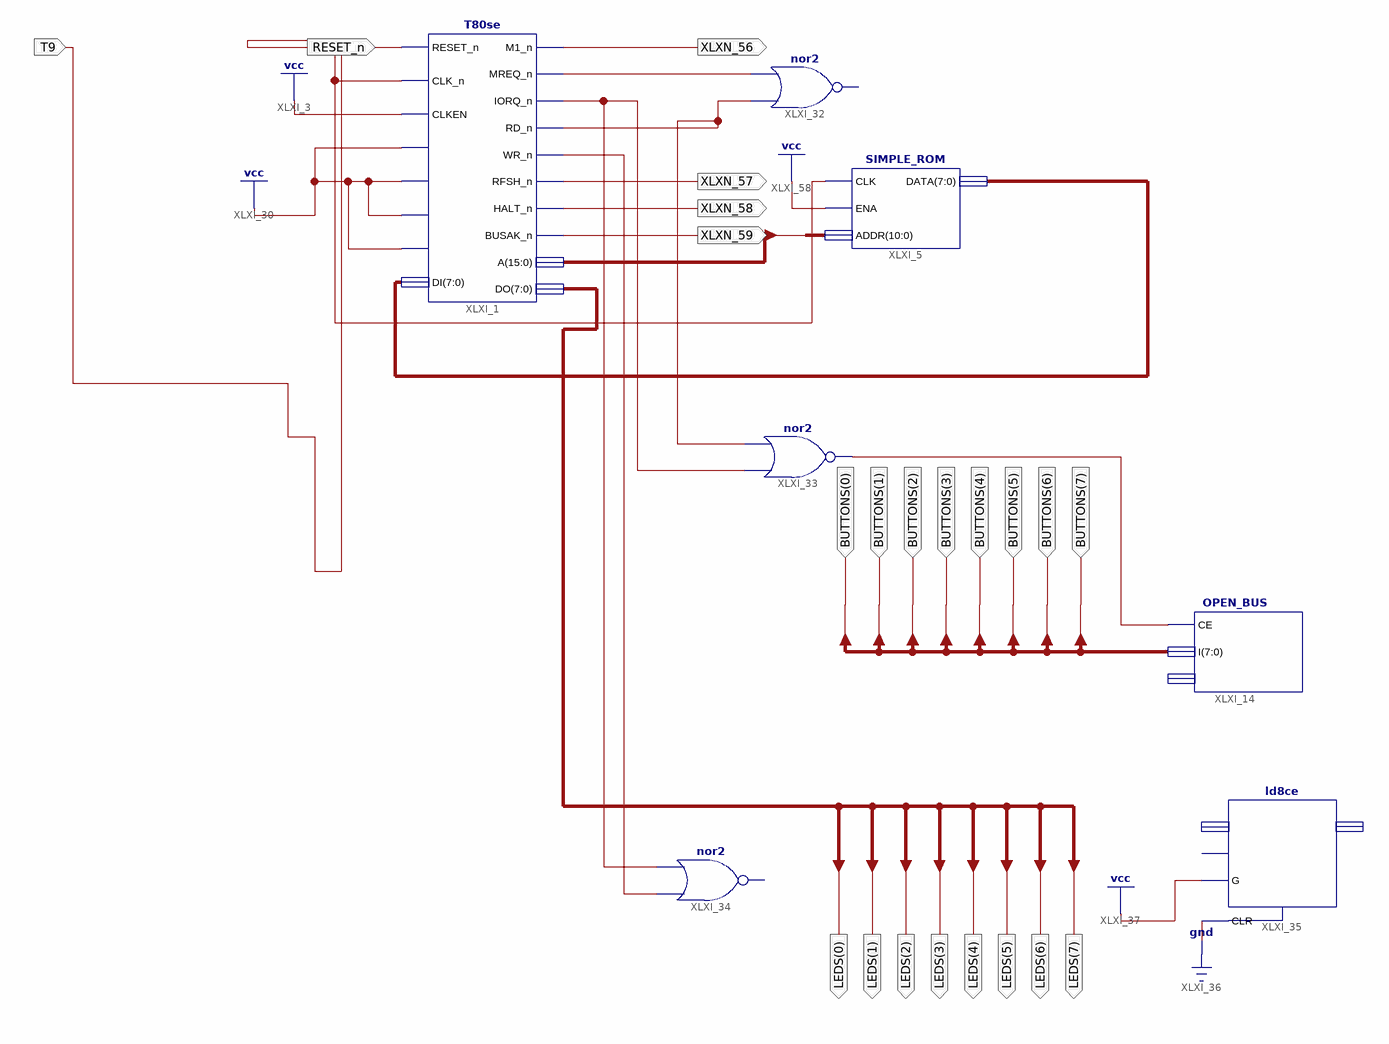
[diagram p0: schematic sheet 1]
// Xilinx ISE schematic ZAP_barbare.sch (spartan3) as structural Verilog: 7 symbols, 22 ports
module ZAP_barbare (
  input  RESET_n,
  input  [7:0] BUTTONS,
  input  T9,
  output XLXN_56,
  output XLXN_57,
  output XLXN_58,
  output XLXN_59,
  output [7:0] LEDS
);

  wire XLXN_10, XLXN_11, XLXN_31, XLXN_33, XLXN_83;
  wire [7:0] XLXN_189;
  wire [15:0] ADDRESSES;

  T80se XLXI_1 (
    .RESET_n(RESET_n), .CLK_n(T9), .CLKEN(1'b1), .WAIT_n(1'b1), .INT_n(1'b1), .NMI_n(1'b1), .BUSRQ_n(1'b1),
    .DI(XLXN_189), .M1_n(XLXN_56), .MREQ_n(XLXN_10), .IORQ_n(XLXN_83), .RD_n(XLXN_11), .WR_n(XLXN_33),
    .RFSH_n(XLXN_57), .HALT_n(XLXN_58), .BUSAK_n(XLXN_59), .A(ADDRESSES), .DO(LEDS));
  SIMPLE_ROM XLXI_5 (.CLK(T9), .ENA(1'b1), .ADDR(ADDRESSES[10:0]), .DATA(XLXN_189));
  // nor2 XLXI_32 has open pins: I0=XLXN_11, I1=XLXN_10, O=open
  // nor2 XLXI_34 has open pins: I0=XLXN_33, I1=XLXN_83, O=open
  ld8ce XLXI_35 (.CLR(1'b0), .G(1'b1));  // open: D, GE, Q
  OPEN_BUS XLXI_14 (.CE(XLXN_31), .I(BUTTONS));  // open: O
  nor XLXI_33 (XLXN_31, XLXN_83, XLXN_11);
endmodule
